# Altium schematic sheet USB_HUB.SchDoc: RasPiCompute_USB_HUB
size B; Engineer: Benjamin Beaudoin; Revision: v0.1
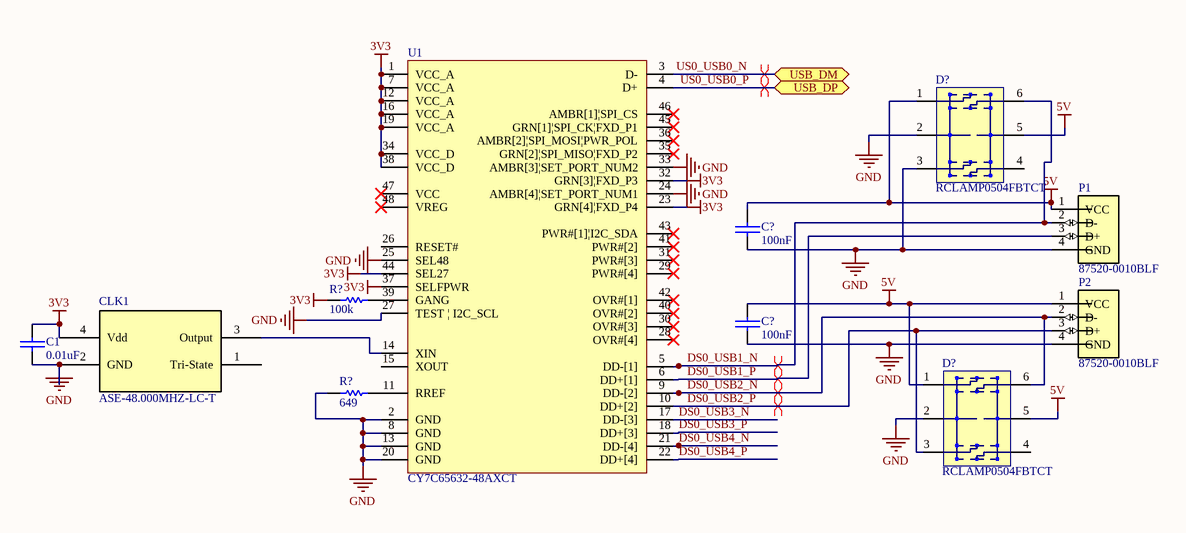
[diagram p0: USB_HUB.SchDoc]

## Parts
(Parts that share a designator on the sheet are numbered #1, #2 ... from top to bottom, then left to right.)
C1  0.01uF  [0402C]
C?#1  100nF  [0402C]
C?#2  100nF  [0402C]
CLK1  ASE-48.000MHZ-LC-T  [ASE-48.000MHZ-LC-T]
D?#1  RCLAMP0504FBTCT
D?#2  RCLAMP0504FBTCT
P1  87520-0010BLF  [FCI_87520-0010BLF]
P2  87520-0010BLF  [FCI_87520-0010BLF]
R?#1  100k  [0402C]
R?#2  649  [0402C]
U1  CY7C65632-48AXCT  [TQFP-48]

## Ports
USB_DM, USB_DP

## Nets
3V3: C1.1 CLK1.4(Vdd) R?#1.1 U1.1(VCC_A) U1.7(VCC_A) U1.12(VCC_A) U1.16(VCC_A) U1.19(VCC_A) U1.23(GRN[4]|FXD_P4) U1.32(GRN[3]|FXD_P3) U1.34(VCC_D) U1.37(SELFPWR) U1.38(VCC_D) U1.44(SEL27)
5V: C?#1.1 C?#2.1 D?#1.1 D?#1.5 D?#2.1 D?#2.5 P1.1(VCC) P2.1(VCC)
GND: C1.2 C?#1.2 C?#2.2 CLK1.2(GND) D?#1.2 D?#1.3 D?#2.2 P1.4(GND) P2.4(GND) R?#2.1 U1.2(GND) U1.8(GND) U1.13(GND) U1.20(GND) U1.24(AMBR[4]|SET_PORT_NUM1) U1.25(SEL48) U1.27(TEST_|_I2C_SCL) U1.33(AMBR[3]|SET_PORT_NUM2)
DS0_USB1_N: D?#1.6 P1.2(D-) U1.5(DD-[1])
DS0_USB1_P: P1.3(D+) U1.6(DD+[1])
DS0_USB2_N: D?#2.6 P2.2(D-) U1.9(DD-[2])
DS0_USB2_P: D?#2.3 P2.3(D+) U1.10(DD+[2])
DS0_USB3_N: U1.17(DD-[3])
DS0_USB3_P: U1.18(DD+[3])
DS0_USB4_N: U1.21(DD-[4])
DS0_USB4_P: U1.22(DD+[4])
US0_USB0_N: U1.3(D-) ; port USB_DM
US0_USB0_P: U1.4(D+) ; port USB_DP
NetCLK1_3: CLK1.3(Output) U1.14(XIN)
NetR?#1_2: R?#1.2 U1.39(GANG)
NetR?#2_2: R?#2.2 U1.11(RREF)

Not connected (* = marked no-connect by the designer): CLK1 1(Tri-State); D?#1 4(0); D?#2 4(0); U1 15(XOUT) 26(RESET#) 28(OVR#[4])* 29(PWR#[4])* 30(OVR#[3])* 31(PWR#[3])* 35(GRN[2]|SPI_MISO|FXD_P2)* 36(AMBR[2]|SPI_MOSI|PWR_POL)* 40(OVR#[2])* 41(PWR#[2])* 42(OVR#[1])* 43(PWR#[1]|I2C_SDA)* 45(GRN[1]|SPI_CK|FXD_P1)* 46(AMBR[1]|SPI_CS)* 47(VCC)* 48(VREG)*

## Layout directives
differential pair: DS0_USB1_N, DS0_USB1_P, DS0_USB2_N, DS0_USB2_P, US0_USB0_N, US0_USB0_P

## Library data of the parts
C1 C?#1 C?#2 = C: Capacitor; Power_WV_SRF: 25V; MFGPN: *; MFG: *; Tolerance: *; TempCo: *; Distributor: *; CMPN: *
  C1: Value: 0.01uF
  C?#1 C?#2: Value: 100nF
CLK1 = ASE-48.000MHZ-LC-T: OSC XO 48.000MHZ CMOS SMD
D?#1 D?#2 = RCLAMP0504FBTCT: TVS DIODE 5V 17.5V SC70-6
P1 P2 = 87520-0010BLF: 87520 Series Single Port 4 Contact Unshielded Board Lock USB-A Receptacle; MF: Amphenol ICC; Digi-Key_Purchase_URL: https://www.digikey.com/product-detail/en/amphenol-fci/87520-0010BLF/609-1045-ND/1001359?utm_source=snapeda&utm_medium=aggregator&utm_campaign=symbol; Digi-Key_Part_Number: 609-1045-ND; Package: None; SnapEDA_Link: https://www.snapeda.com/parts/87520-0010BLF/Amphenol%20ICC/view-part/?ref=snap; MP: 87520-0010BLF; Value: *
R?#1 = R: Resistor; Tolerance: 5%; Value: 100k; Power_WV_SRF: *; MFG: *; MFGPN: *; Distributor: *; CMPN: *
R?#2 = R: Resistor; Tolerance: 1%; Value: 649; Power_WV_SRF: *; MFG: *; MFGPN: *; Distributor: *; CMPN: *